# Altium schematic sheet Power.SchDoc: Balance_Car主控板电源
size A4; Date: 2017/3/23; DrawnBy: 卢晗; Engineer: 卢晗; DocumentNumber: 2; Revision: 1.0; ProjectName: Balance_Ccar
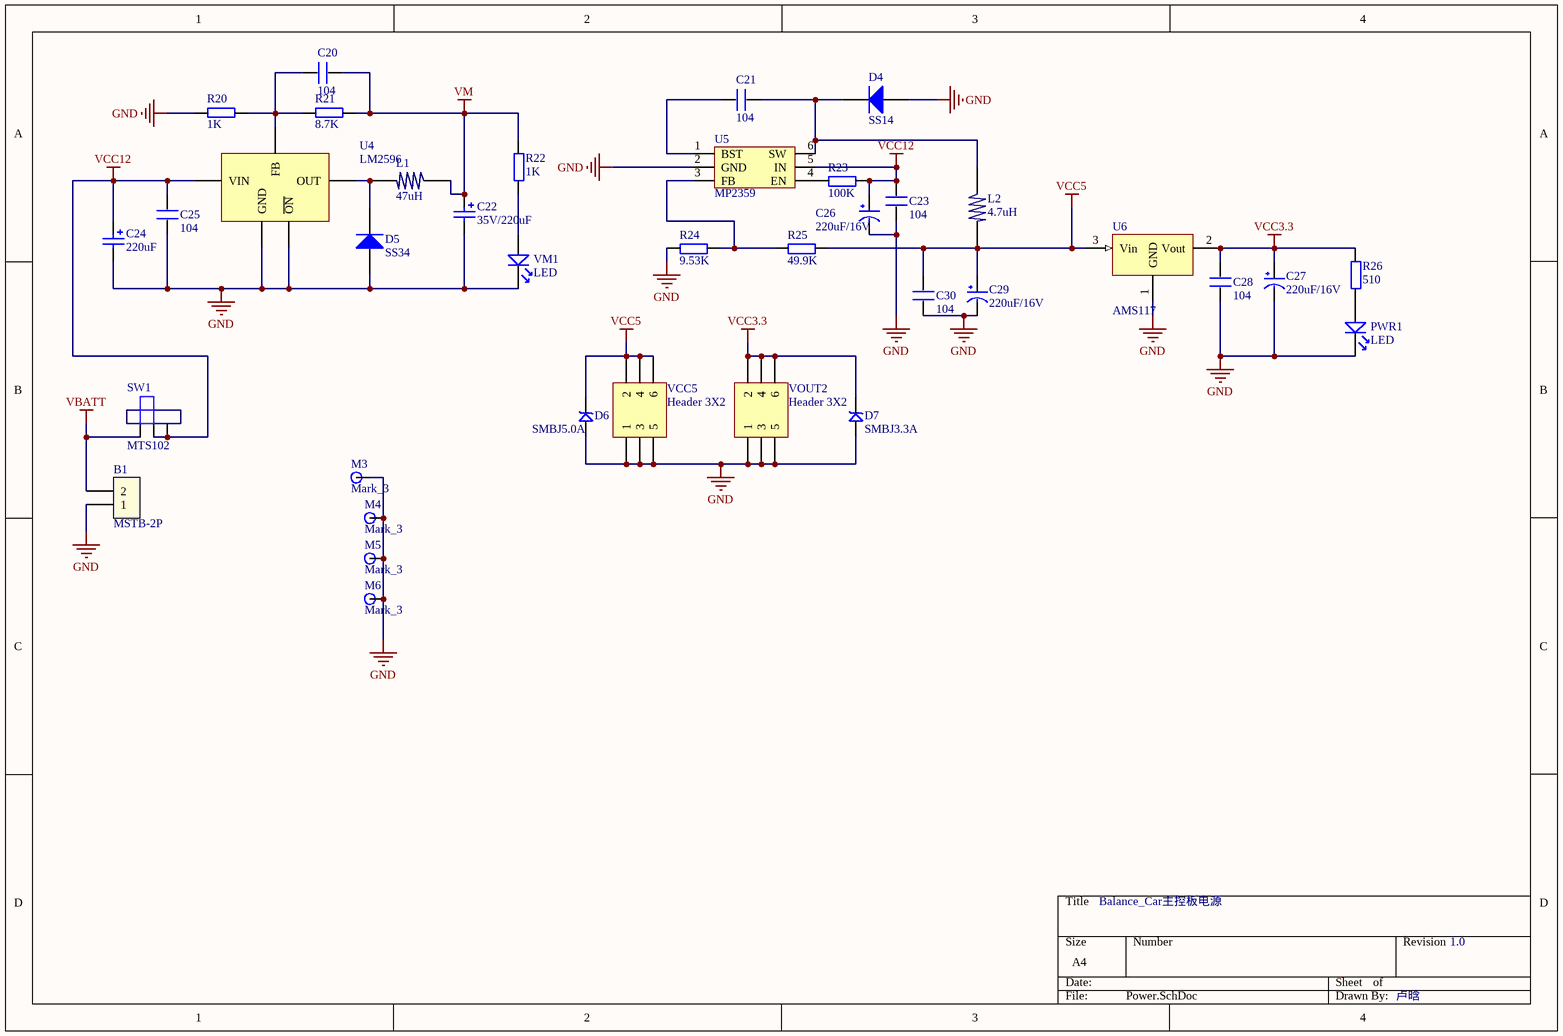
[diagram p0: Power.SchDoc]

## Parts
B1  MSTB-2P  [MSTB-2P]
C20  104  [0603C]
C21  104  [0603C]
C22  35V/220uF  [C_AUL-9.0*8.2]
C23  104  [0603C]
C24  220uF  [C_AUL-9.0*8.2]
C25  104  [0603C]
C26  220uF/16V  [C_AUL-6.6*7]
C27  220uF/16V  [C_AUL-6.6*7]
C28  104  [0603C]
C29  220uF/16V  [C_AUL-6.6*7]
C30  104  [0603C]
D4  SS14  [SMA/DO-214AC]
D5  SS34  [SMB/DO-214AA]
D6  SMBJ5.0A  [SMB/DO-214AA]
D7  SMBJ3.3A  [SMB/DO-214AA]
L1  47uH  [CDRH127]
L2  4.7uH  [CDRH74]
M3  Mark_3  [Mark3]
M4  Mark_3  [Mark3]
M5  Mark_3  [Mark3]
M6  Mark_3  [Mark3]
PWR1  LED  [0603D-R]
R20  1K  [0603R]
R21  8.7K  [0603R]
R22  1K  [0603R]
R23  100K  [0603R]
R24  9.53K  [0603R]
R25  49.9K  [0603R]
R26  510  [0603R]
SW1  MTS102  [MTS102]
U4  LM2596  [TO-263-5]
U5  MP2359  [SOT23-6L(PITCH 0.95)]
U6  AMS117  [SOT-223]
VCC5  Header 3X2  [HDR2X3]
VM1  LED  [0603D-R]
VOUT2  Header 3X2  [HDR2X3]

## Nets
GND: B1.1 C22.2 C23.1 C24.2 C25.1 C26.2(GND) C27.2(GND) C28.1 C29.2(GND) C30.1 D4.1(A) D5.1(A) D6.1 D7.1 M3.1 M4.1 M5.1 M6.1 PWR1.2 R20.2 R24.1 U4.3(GND) U4.5(~{ON}) U5.2(GND) U6.1(GND) VCC5.1 VCC5.3 VCC5.5 VM1.2 VOUT2.1 VOUT2.3 VOUT2.5
VBATT: B1.2 SW1.1
VCC3.3: C27.1(VCC) C28.2 D7.2 R26.2 U6.2(Vout) VOUT2.2 VOUT2.4 VOUT2.6
VCC5: C29.1(VCC) C30.2 D6.2 L2.1 R25.2 U6.3(Vin) VCC5.2 VCC5.4 VCC5.6
VCC12: C23.2 C24.1 C25.2 C26.1(VCC) R23.2 SW1.2 SW1.3 U4.1(VIN) U5.5(IN)
VM: C20.1 C22.1 L1.2 R21.1 R22.2
NetC20_2: C20.2 R20.1 R21.2 U4.4(FB)
NetC21_1: C21.1 U5.1(BST)
NetC21_2: C21.2 D4.2(K) L2.2 U5.6(SW)
NetD5_2: D5.2(K) L1.1 U4.2(OUT)
NetPWR1_1: PWR1.1 R26.1
NetR22_1: R22.1 VM1.1
NetR23_1: R23.1 U5.4(EN)
NetR24_2: R24.2 R25.1 U5.3(FB)

## Library data of the parts
C20 C21 C23 C25 C30 = C
C22 C24 = Cap_Alumi: Aluminum cap; Manuf_1: VISHAY; Manuf_Part_1: 293D106X9010A2TE3; Value: 10uF; Revision: July-2002: Re-released for DXP Platform.; Order: *; ECCN_US/EU: n/a
C26 C27 C29 = CAP
C28 = C21
D4 D5 = Diode: Default Diode; Code - JEDEC: DO-214-AB; Ordered by: STM; ECCN_US/EU: EAR99/NEC; Published: 8-Jun-2000; Revision: July-2002: Re-released for DXP Platform.; Publisher: Altium Limited
D6 D7 = SMBJ: TVS
L1 L2 = L
M3-M6 = Mark_3: 3mm安装孔
R20-R26 = R
U5 = MP2359: DC DC Step Down IC
U6 = AMS1117
VCC5 VOUT2 = Header 3X2: Header, 3-Pin, Dual row; LatestRevisionDate: 17-Jul-2002; LatestRevisionNote: Re-released for DXP Platform.; Publisher: Altium Limited